# Altium schematic sheet SBCarrierBoard.SchDoc: SB Carrier Board
size 431 x 279 mm; Author: Stanley Galloway; CompanyName: SailBot; Revision: A; SheetNumber: 1; SheetTotal: 1; SCH_SCALE: B
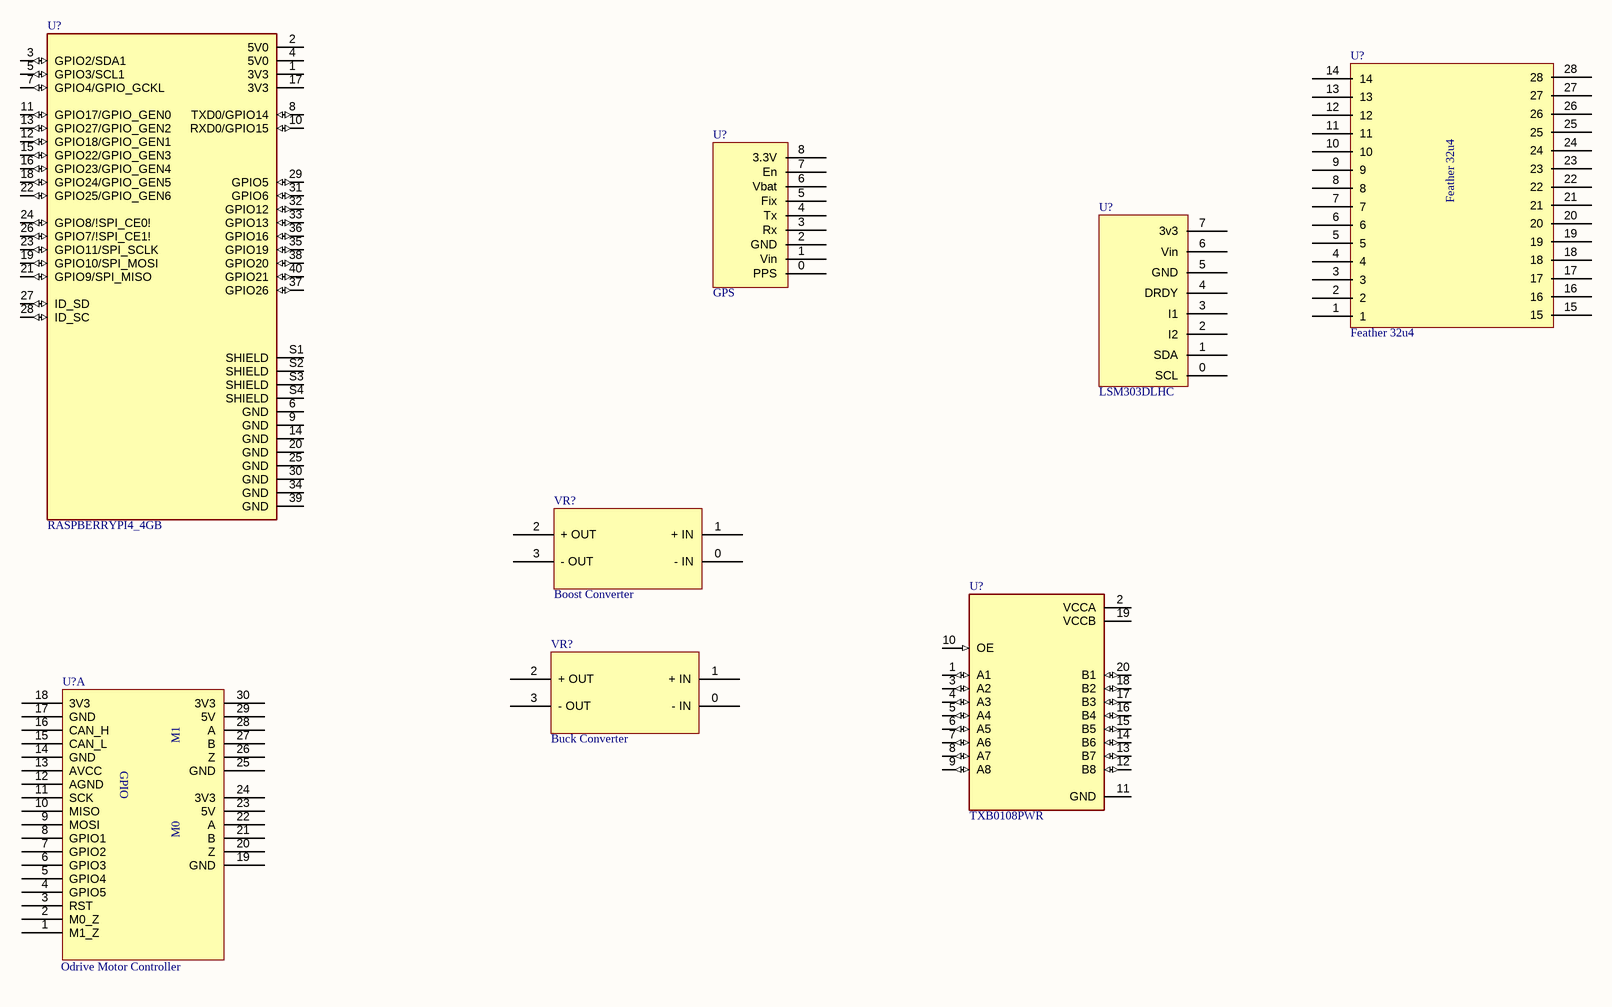
[diagram p0: SBCarrierBoard.SchDoc]

## Parts
(Parts that share a designator on the sheet are numbered #1, #2 ... from top to bottom, then left to right.)
U?#1  RASPBERRYPI4_4GB  [RPi Pad]
U?#2  GPS  [GPS Pad]
U?#3  Feather 32u4  [LoRa32u4]
U?#4  LSM303DLHC
U?#5  TXB0108PWR
U?#6  Odrive Motor Controller  [Odrive Motor Controller Mount]  (part A of 2)
VR?#1  Boost Converter  [Boost Pad]
VR?#2  Buck Converter  [BUCK Pad]

## Nets

Not connected (* = marked no-connect by the designer): U?#1 1(3V3) 2(5V0) 3(GPIO2/SDA1) 4(5V0) 5(GPIO3/SCL1) 6(GND) 7(GPIO4/GPIO_GCKL) 8(TXD0/GPIO14) 9(GND) 10(RXD0/GPIO15) 11(GPIO17/GPIO_GEN0) 12(GPIO18/GPIO_GEN1) 13(GPIO27/GPIO_GEN2) 14(GND) 15(GPIO22/GPIO_GEN3) 16(GPIO23/GPIO_GEN4) 17(3V3) 18(GPIO24/GPIO_GEN5) 19(GPIO10/SPI_MOSI) 20(GND) 21(GPIO9/SPI_MISO) 22(GPIO25/GPIO_GEN6) 23(GPIO11/SPI_SCLK) 24(GPIO8/!SPI_CE0!) 25(GND) 26(GPIO7/!SPI_CE1!) 27(ID_SD) 28(ID_SC) 29(GPIO5) 30(GND) 31(GPIO6) 32(GPIO12) 33(GPIO13) 34(GND) 35(GPIO19) 36(GPIO16) 37(GPIO26) 38(GPIO20) 39(GND) 40(GPIO21) S1(SHIELD) S2(SHIELD) S3(SHIELD) S4(SHIELD); U?#2 0(PPS) 1(Vin) 2(GND) 3(Rx) 4(Tx) 5(Fix) 6(Vbat) 7(En) 8(3.3V); U?#3 1 2 3 4 5 6 7 8 9 10 11 12 13 14 15 16 17 18 19 20 21 22 23 24 25 26 27 28; U?#4 0(SCL) 1(SDA) 2(I2) 3(I1) 4(DRDY) 5(GND) 6(Vin) 7(3v3); U?#5 1(A1) 2(VCCA) 3(A2) 4(A3) 5(A4) 6(A5) 7(A6) 8(A7) 9(A8) 10(OE) 11(GND) 12(B8) 13(B7) 14(B6) 15(B5) 16(B4) 17(B3) 18(B2) 19(VCCB) 20(B1); U?#6 1(M1_Z) 2(M0_Z) 3(RST) 4(GPIO5) 5(GPIO4) 6(GPIO3) 7(GPIO2) 8(GPIO1) 9(MOSI) 10(MISO) 11(SCK) 12(AGND) 13(AVCC) 14(GND) 15(CAN_L) 16(CAN_H) 17(GND) 18(3V3) 19(GND) 20(Z) 21(B) 22(A) 23(5V) 24(3V3) 25(GND) 26(Z) 27(B) 28(A) 29(5V) 30(3V3); VR?#1 0(-_IN) 1(+_IN) 2(+_OUT) 3(-_OUT); VR?#2 0(-_IN) 1(+_IN) 2(+_OUT) 3(-_OUT)

## Notes on the sheet
- DWG. NO.
- REV.
- SHT.
- THIS DOCUMENT AND THE DATA DISCLOSED HEREIN OR HEREWITH IS THE PROPERTY OF ALTIUM LIMITED AND MAY BE FREELY DISTRIBUTED IN WHOLE. NO RIGHTS ARE RESERVED OR EXPRESS OR IMPLIED WARANTEE GIVEN.
- REVISION
- DESCRIPTION
- DATE
- APPROVED
- ENG:
- APPROVALS
- PROJECT
- DSN:
- CHK:
- REFERENCE DOCUMENTS
- PROJECT REVISION:
- TITLE
- DOCUMENT REVISION:
- DESIGN ITEM:
- BOM:
- FAB DWG:
- PCB DWG:
- ASSY DWG:
- SCALE:
- SIZE
- B
- CAGE CODE
- FILE NAME
- DWG NO.
- SHEET
- OF
- REV
- (in symbol Odrive Motor Controller, part A) M1; GPIO; M0

## Library data of the parts
U?#1 = RASPBERRYPI4_4GB: BCM2711 Raspberry Pi 4 Model B 4GB - ARMÂ® CortexÂ®-A72 MPU Embedded Evaluation Board; MF: Raspberry Pi Foundation (NF); MP: RASPBERRYPI4 4GB; Price: None; Availability: Unavailable; Package: None; SnapEDA_Link: https://www.snapeda.com/parts/RASPBERRYPI4%204GB/Raspberry%20Pi/view-part/3832294/?ref=snap; Value: *
U?#5 = TXB0108PWR: 8-Bit Bidirectional Voltage-Level Shifter with Auto Direction Sensing and +/-15-kV ESD Protect 20-TSSOP -40 to 85; MF: Texas Instruments; Package: TSSOP-20 Texas Instruments; Value: *; Check_prices: https://www.snapeda.com/parts/TXB0108PWR/Texas%20Instruments/view-part/45111/?ref=eda; Purchase-URL: https://pricing.snapeda.com/search/part/TXB0108PWR/?ref=eda; Availability: Warning; SnapEDA_Link: https://www.snapeda.com/parts/TXB0108PWR/Texas%20Instruments/view-part/45111/?ref=snap; Price: None; MP: TXB0108PWR